# EAGLE design QFN-24_4x4mm_Breakout (EAGLE 9.6.2)
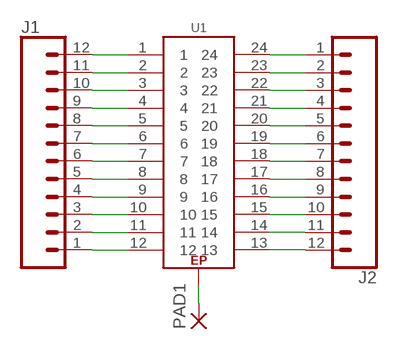
[diagram p0: schematic, sheet 1]

## Parts
J1  CONN_12  [1X12]
J2  CONN_12  [1X12]
PAD1  SMD2  [SMD1,27-2,54]
U1  GEN_24_EPQFN-24  [QFN24]

## Nets
N$1: PAD1.1(P) U1.EP
N$2: J1.12 U1.1
N$3: J1.11 U1.2
N$4: J1.10 U1.3
N$5: J1.9 U1.4
N$6: J1.8 U1.5
N$7: J1.7 U1.6
N$8: J1.6 U1.7
N$9: J1.5 U1.8
N$10: J1.4 U1.9
N$11: J1.3 U1.10
N$12: J1.2 U1.11
N$13: J1.1 U1.12
N$14: J2.12 U1.13
N$15: J2.11 U1.14
N$16: J2.10 U1.15
N$17: J2.9 U1.16
N$18: J2.8 U1.17
N$19: J2.7 U1.18
N$20: J2.6 U1.19
N$21: J2.5 U1.20
N$22: J2.4 U1.21
N$23: J2.3 U1.22
N$24: J2.2 U1.23
N$25: J2.1 U1.24

## Library data of the parts
J1 J2 = bschulz:CONN_12: Multi connection point. Often used as Generic Header-pin footprint for 0.1 inch spaced/style header connections On any of the 0.1 inch spaced packages, you can populate with these: Break Away Headers - Straight <https://www.sparkfun.com/products/116> (PRT-00116) Break Away Male Headers - Right Angle <https://www.sparkfun.com/products/553> (PRT-00553) Female Headers <https://www.sparkfun.com/products/115> (PRT-00115) Break Away Headers - Machine Pin <https://www.sparkfun.com/products/117> (PRT-00117) Break Away Female Headers - Swiss Machine Pin <https://www.sparkfun.com/products/743> (PRT-00743) For SCREWTERMINALS and SPRING TERMINALS visit here: Screw Terimnals on SparkFun.com <https://www.sparkfun.com/search/results?term=Screw+Terminals> (5mm/3.5mm/2.54mm spacing) This device is also useful as a general connection point to wire up your design to another part of your project. Our various solder wires solder well into these plated through hole pads. Hook-Up Wire - Assortment (Stranded, 22 AWG) <https://www.sparkfun.com/products/11375> (PRT-11375) Hook-Up Wire - Assortment (Solid Core, 22 AWG) <https://www.sparkfun.com/products/11367> (PRT-11367) View the entire wire category on our website here <https://www.sparkfun.com/categories/141> Special notes: Molex polarized connector foot print use with SKU : PRT-08231 with associated crimp pins and housings. 1MM SMD Version SKU: PRT-10208 NOTES ON THE VARIANTS LOCK and LOCK_LONGPADS... This footprint was designed to help hold the alignment of a through-hole component (i.e. 6-pin header) while soldering it into place. You may notice that each hole has been shifted either up or down by 0.005 of an inch from it's more standard position (which is a perfectly straight line). This slight alteration caused the pins (the squares in the middle) to touch the edges of the holes. Because they are alternating, it causes a "brace" to hold the component in place. 0.005 has proven to be the perfect amount of "off-center" position when using our standard breakaway headers. Although looks a little odd when you look at the bare footprint, once you have a header in there, the alteration is very hard to notice. Also,if you push a header all the way into place, it is covered up entirely on the bottom side.
PAD1 = bschulz:SMD2: SMD PAD; DIGIKEY: N/A; MF: N/A; MPN: DNP
U1 = bschulz:GEN_24_EP: Generic 20 Pin Package for Breakout Boards

## Board
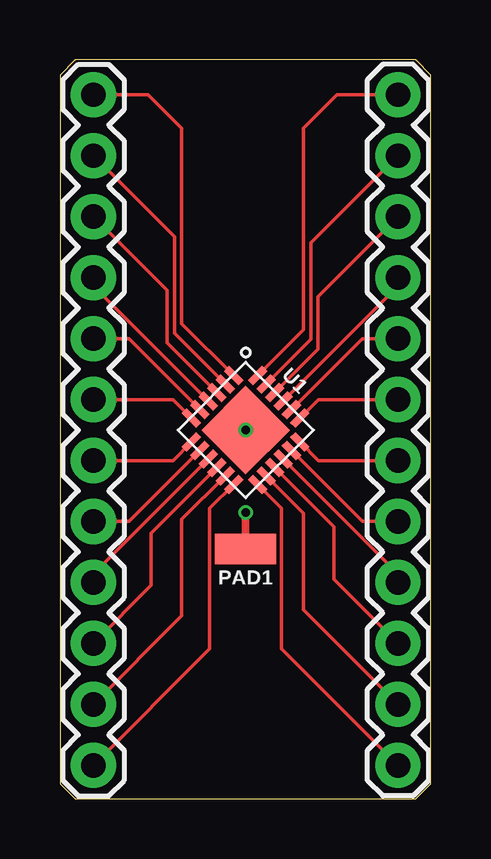
[diagram p1: board, top side]
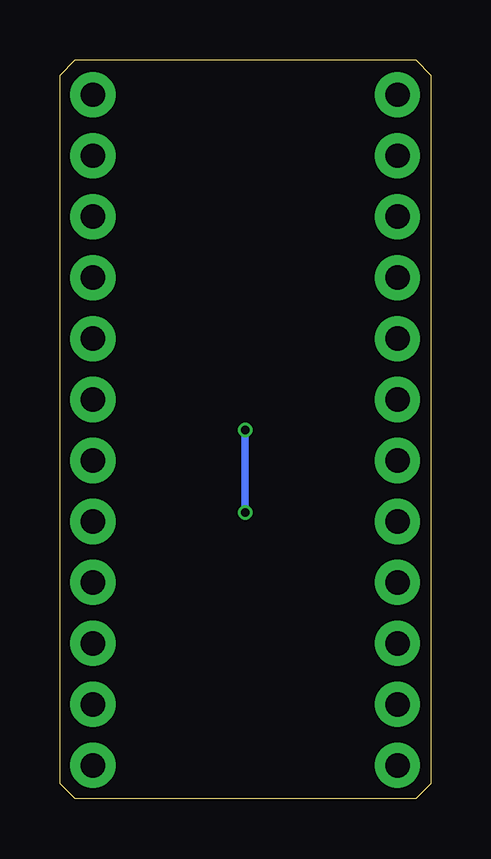
[diagram p2: board, bottom side, seen from below]

Size 15.47 x 30.79 mm. Coordinates in mm from the lower left corner, seen from the top.
Outline: 0,30.15 0,0.64 0.64,0 14.84,0 15.47,0.64 15.47,30.15 14.84,30.79 0.64,30.79 0,30.15
Copper layers (1*16): Top 0.035559375mm / dielectric 1.6mm / Bottom 0.035559375mm
Design rules "oshpark-2layer": minimum track width 6mil, minimum drill 10mil, track to track 6mil, track to pad 6mil, pad to pad 6mil, via to via 6mil, smd to smd 6mil, copper to edge 15mil, drill to drill 6mil, minimum pad ring 5mil, minimum via ring 5mil, stop-mask expansion 2.5mil, vias tented up to drill 0mil, thermal gap 10mil

### Footprints (pad centres in the part's own frame; a part is rotated, then mirrored left to right if it is on the bottom)
1X12 = drill 1.016 pad 1.88: 1 0,0; 2 2.54,0; 3 5.08,0; 4 7.62,0; 5 10.16,0; 6 12.7,0; 7 15.24,0; 8 17.78,0; 9 20.32,0; 10 22.86,0; 11 25.4,0; 12 27.94,0
SMD1,27-2,54 = smd 1.27 x 2.54: 1 0,0
QFN24 = smd 0.85 x 0.3: 1 -1.95,1.25; 2 -1.95,0.75; 3 -1.95,0.25; 4 -1.95,-0.25; 5 -1.95,-0.75; 6 -1.95,-1.25; 13 1.95,-1.25; 14 1.95,-0.75; 15 1.95,-0.25; 16 1.95,0.25; 17 1.95,0.75; 18 1.95,1.25 | smd 0.3 x 0.85: 7 -1.25,-1.95; 8 -0.75,-1.95; 9 -0.25,-1.95; 10 0.25,-1.95; 11 0.75,-1.95; 12 1.25,-1.95; 19 1.25,1.95; 20 0.75,1.95; 21 0.25,1.95; 22 -0.25,1.95; 23 -0.75,1.95; 24 -1.25,1.95 | smd 2.6 x 2.6: EP 0,0

### Placement (x,y rotation side)
J1  1.4,1.4 90 top
J2  14.1,29.34 270 top
PAD1  7.75,10.41 90 top
U1  7.75,15.37 315 top

### Tracks (layer width: path | path; a pad name or v marks a point on that pad's centre or on a via)
N$1  (via drill 0.35)
  Top 0.305: PAD1.1 v7.75,11.94
  Bottom 0.305: v7.75,11.94 U1.EP
  other vias: 7.75,15.37
N$2
  Top 0.152: J1.12 3.68,29.34 5.08,27.94 5.08,19.8 U1.1
N$3
  Top 0.152: U1.2 4.78,19.4 4.78,23.42 J1.11
N$4
  Top 0.152: U1.3 4.47,19 4.47,21.18 J1.10
N$5
  Top 0.152: U1.4 1.4,21.36 J1.9
N$6
  Top 0.152: U1.5 2.88,19.18 J1.8
N$7
  Top 0.152: U1.6 4.71,16.64 J1.7
N$8
  Top 0.152: U1.7 4.71,14.1 J1.6
N$9
  Top 0.152: U1.8 2.88,11.56 J1.5
N$10
  Top 0.152: U1.9 1.4,9.37 J1.4
N$11
  Top 0.152: U1.10 3.81,11.08 3.81,8.89 J1.3
N$12
  Top 0.152: U1.11 5.08,11.64 5.08,7.62 J1.2
N$13
  Top 0.152: U1.12 6.25,12.1 6.25,6.25 J1.1
N$14
  Top 0.152: U1.13 9.25,12.1 9.25,6.25 J2.12
N$15
  Top 0.152: U1.14 10.16,11.89 10.16,7.87 J2.11
N$16
  Top 0.152: U1.15 11.43,11.33 11.43,9.14 J2.10
N$17
  Top 0.152: U1.16 14.1,9.37 J2.9
N$18
  Top 0.152: U1.17 12.62,11.56 J2.8
N$19
  Top 0.152: U1.18 10.79,14.1 J2.7
N$20
  Top 0.152: U1.19 10.79,16.64 J2.6
N$21
  Top 0.152: U1.20 12.62,19.18 J2.5
N$22
  Top 0.152: U1.21 14.1,21.36 J2.4
N$23
  Top 0.152: J2.3 10.77,20.93 10.77,18.74 U1.22
N$24
  Top 0.152: J2.2 10.46,23.16 10.46,19.14 U1.23
N$25
  Top 0.152: J2.1 11.56,29.34 10.16,27.94 10.16,19.55 U1.24

### Text on the board
tDocu: 1 | 24 | 2 | QFN-24 / 4x4mm | 23 | 3 | 22 | 4 | 21 | 5 | 20 | 6 | 19 | 7 | 18 | 8 | 17 | 9 | 16 | 10 | 15 | 11 | Break44 / B. Schulz | 14 | 12 | 13